# Altium schematic sheet QCopterMV_PWR_Sch.SchDoc: QCopterMV-PWR
size 127 x 101 mm; Author: Hom; CompanyName: KitSprout; DrawnBy: Hom; Engineer: Hom; Organization: KitSprout; Revision: A; SheetNumber: 1; SheetTotal: 1; License: CC BY-SA 4.0; Version: 2.0; LibVersion: 2.7; PageSetup: Record=PageOptions|CenterHorizontal=True|CenterVertical=True|PrintScale=1.00|XCorrection=1.00|YCorrection=1.00|PrintKind=0|BorderSize=5000000|LeftOffset=0|BottomOffset=0|Orientation=2|PaperLength=1000|PaperWidth=1000|Scale=100|PaperSource=7|PrintQuality=-4|MediaType=1|DitherType=10|PaperKind=A4|PrintScaleMode=0
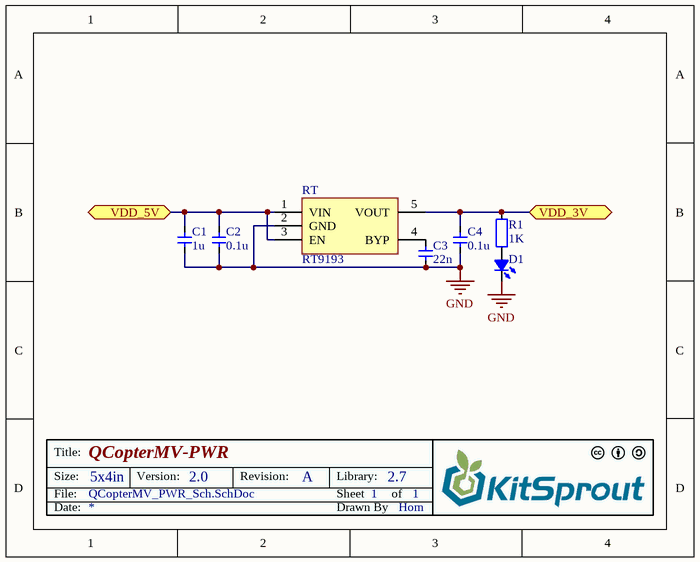
[diagram p0: QCopterMV_PWR_Sch.SchDoc]

## Parts
C1  value 1u  [CAP_0603]  (hidden comment: Cap_0603)
C2  value 0.1u  [CAP_0603]  (hidden comment: Cap_0603)
C3  value 22n  [CAP_0603]  (hidden comment: Cap_0603)
C4  value 0.1u  [CAP_0603]  (hidden comment: Cap_0603)
D1  LED_0805  [LED_0805_ORANGE]  (value not drawn)
R1  value 1K  [RES_0603]  (hidden comment: Res_0603)
RT  RT9193  [SOT23-5]

## Ports
VDD_3V, VDD_5V

## Nets
GND: C1.1 C2.1 C3.2 C4.1 D1.2(K) RT.2(GND)
VDD_3V: C4.2 R1.2 RT.5(VOUT) ; port VDD_3V
VDD_5V: C1.2 C2.2 RT.1(VIN) RT.3(EN) ; port VDD_5V
NetC3_1: C3.1 RT.4(BYP)
NetD1_1: D1.1(A) R1.1

## Notes on the sheet
- Title:
- Size:
- Date:
- File:
- 5x4in
- Version:
- Revision:
- Sheet
- Drawn By
- Library:
- of

## Library data of the parts
C1-C4 = Cap_0603: Capacitor
D1 = LED_0805: LED
R1 = Res_0603: Resistor
RT = SP6205: Power